# Altium schematic sheet IO.SchDoc
size A; SheetNumber: 5; SheetTotal: 5
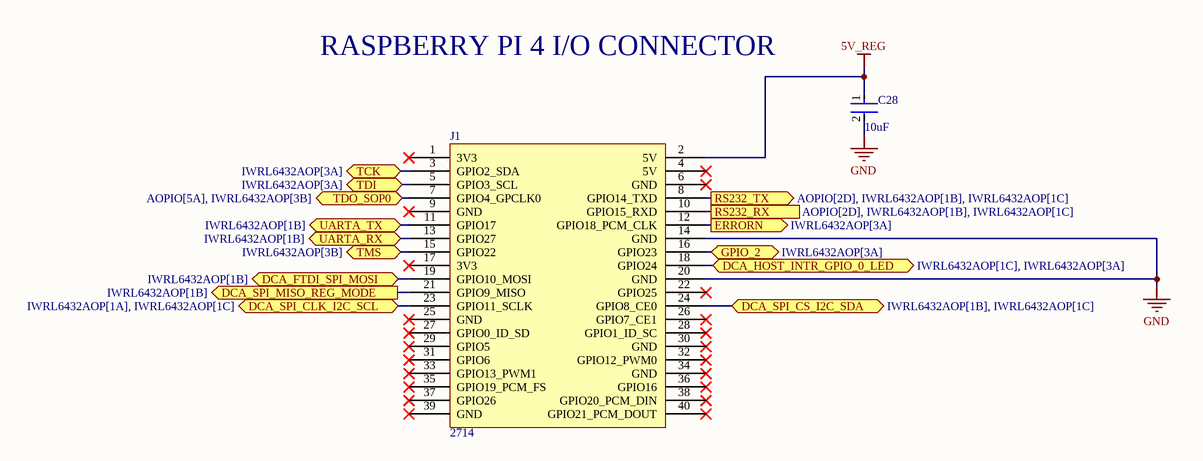
[diagram p0: IO.SchDoc]

## Parts
C28  Capacitance: 10uF  [FP-GRM188-0_2-MFG]  (hidden comment: GRM188C81A106MA73D)
J1  2714  [2714]

## Ports
DCA_FTDI_SPI_MOSI (bidir, see IWRL6432AOP[1B]), DCA_HOST_INTR_GPIO_0_LED (bidir, see IWRL6432AOP[1C], IWRL6432AOP[3A]), DCA_SPI_CLK_I2C_SCL (bidir, see IWRL6432AOP[1A], IWRL6432AOP[1C]), DCA_SPI_CS_I2C_SDA (bidir, see IWRL6432AOP[1B], IWRL6432AOP[1C]), DCA_SPI_MISO_REG_MODE (out, see IWRL6432AOP[1B]), ERRORN (out, see IWRL6432AOP[3A]), GPIO_2 (bidir, see IWRL6432AOP[3A]), RS232_RX (see AOPIO[2D], IWRL6432AOP[1B], IWRL6432AOP[1C]), RS232_TX (out, see AOPIO[2D], IWRL6432AOP[1B], IWRL6432AOP[1C]), TCK (bidir, see IWRL6432AOP[3A]), TDI (bidir, see IWRL6432AOP[3A]), TDO_SOP0 (bidir, see AOPIO[5A], IWRL6432AOP[3B]), TMS (bidir, see IWRL6432AOP[3B]), UARTA_RX (bidir, see IWRL6432AOP[1B]), UARTA_TX (bidir, see IWRL6432AOP[1B])

## Nets
5V_REG: C28.1 J1.2(5V)
GND: C28.2 J1.14(GND) J1.20(GND)
DCA_FTDI_SPI_MOSI: J1.19(GPIO10_MOSI) ; port DCA_FTDI_SPI_MOSI
DCA_HOST_INTR_GPIO_0_LED: J1.18(GPIO24) ; port DCA_HOST_INTR_GPIO_0_LED
DCA_SPI_CLK_I2C_SCL: J1.23(GPIO11_SCLK) ; port DCA_SPI_CLK_I2C_SCL
DCA_SPI_CS_I2C_SDA: J1.24(GPIO8_CE0) ; port DCA_SPI_CS_I2C_SDA
DCA_SPI_MISO_REG_MODE: J1.21(GPIO9_MISO) ; port DCA_SPI_MISO_REG_MODE
ERRORN: J1.12(GPIO18_PCM_CLK) ; port ERRORN
GPIO_2: J1.16(GPIO23) ; port GPIO_2
RS232_RX: J1.10(GPIO15_RXD) ; port RS232_RX
RS232_TX: J1.8(GPIO14_TXD) ; port RS232_TX
TCK: J1.3(GPIO2_SDA) ; port TCK
TDI: J1.5(GPIO3_SCL) ; port TDI
TDO_SOP0: J1.7(GPIO4_GPCLK0) ; port TDO_SOP0
TMS: J1.15(GPIO22) ; port TMS
UARTA_RX: J1.13(GPIO27) ; port UARTA_RX
UARTA_TX: J1.11(GPIO17) ; port UARTA_TX

Not connected (* = marked no-connect by the designer): J1 1(3V3)* 4(5V)* 6(GND)* 9(GND)* 17(3V3)* 22(GPIO25)* 25(GND)* 26(GPIO7_CE1)* 27(GPIO0_ID_SD)* 28(GPIO1_ID_SC)* 29(GPIO5)* 30(GND)* 31(GPIO6)* 32(GPIO12_PWM0)* 33(GPIO13_PWM1)* 34(GND)* 35(GPIO19_PCM_FS)* 36(GPIO16)* 37(GPIO26)* 38(GPIO20_PCM_DIN)* 39(GND)* 40(GPIO21_PCM_DOUT)*

## Notes on the sheet
- RASPBERRY PI 4 I/O CONNECTOR

## Library data of the parts
C28 = CMP-06035-002932-1: Chip Multilayer Ceramic Capacitors for General Purpose, 0603, 10uF, X6S, 22%, 20%, 10V; Case Code (Metric): 1608; Max Operating Temperature: 105°C; Voltage Rating (DC): 10V; Thickness: 0.031inch; Width: 0.031inch; Dielectric: X6S; Lead Free: Lead Free; REACH SVHC: No SVHC; Case/Package: 0603; Length: 0.063inch; Min Operating Temperature: -55°C; Package Quantity: 4000; Voltage Rating: 10V; Tolerance: 20%; Packaging: Cut Tape; Material: Ceramic; Mount: Surface Mount; Case Code (Imperial): 0603; Height: 0.8mm
J1 = 2714: Extra-Tall Smt Gpio Header For Raspberry Pi Hat - 2X20 Extra Tall Female Header |Adafruit 2714; Manufacturer: Adafruit Industries; Supplier: Arrow Electronics; Supplier Part Number: 2714; Manufacturer Part Number: 2714; Category: Headers and Wire Housings; Stock: 1; Pricing: 1=2.95 (USD); RoHS: Non-Compliant; Schedule B: 8536694040, 8536694040|8536694040|8536694040|8536694040|8536694040